# Altium schematic sheet Latch.SchDoc
size A4; SheetNumber: 5; SheetTotal: 6
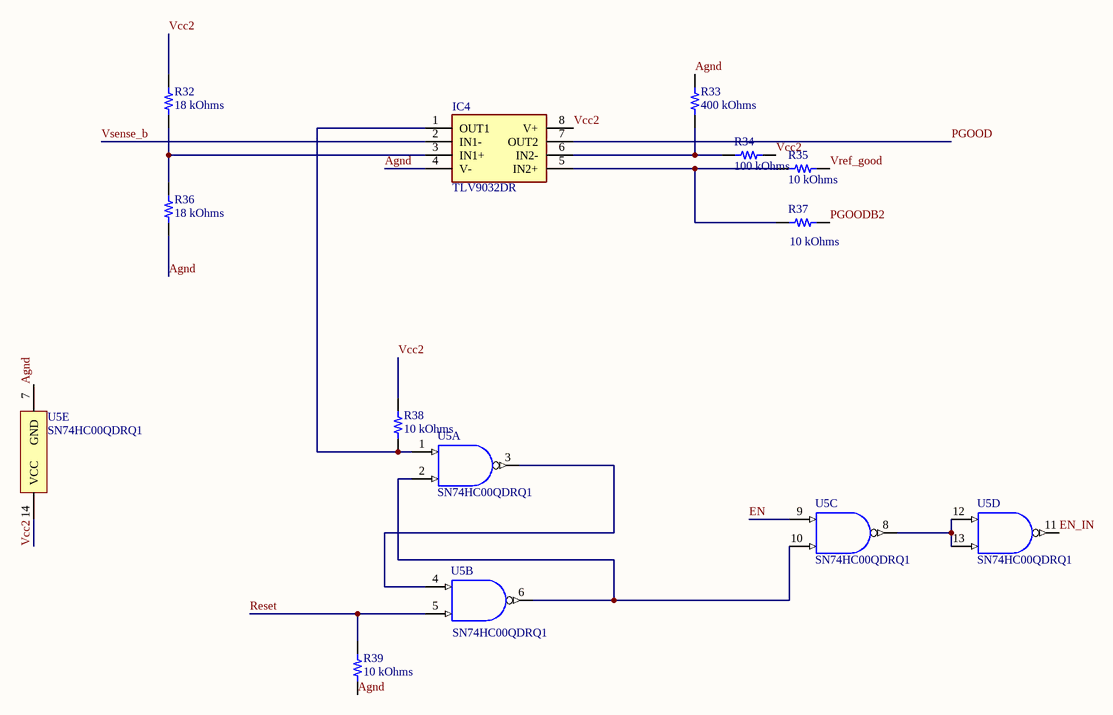
[diagram p0: Latch.SchDoc]

## Parts
IC4  TLV9032DR  [SOIC127P600X175-8N]
R32  18 kOhms  [RES 0603_1608]
R33  400 kOhms  [RES 0603_1608]
R34  100 kOhms  [RES 0603_1608]
R35  10 kOhms  [RES 0603_1608]
R36  18 kOhms  [RES 0603_1608]
R37  10 kOhms  [RES 0603_1608]
R38  10 kOhms  [RES 0603_1608]
R39  10 kOhms  [RES 0603_1608]
U5  SN74HC00QDRQ1  [D0014A_L]  (parts A,B,C,D,E of 5)

## Nets
Agnd: IC4.4(V-) R33.1 R36.2 R39.2 U5.7(GND)
EN: U5.9(3A)
EN_IN: U5.11(4Y)
PGOOD: IC4.7(OUT2)
PGOODB2: R37.1
Reset: R39.1 U5.5(2B)
Vcc2: IC4.8(V+) R32.1 R34.1 R38.1 U5.14(VCC)
Vref_good: R35.1
Vsense_b: IC4.2(IN1-)
NetIC4_1: IC4.1(OUT1) R38.2 U5.1(1A)
NetIC4_3: IC4.3(IN1+) R32.2 R36.1
NetIC4_5: IC4.5(IN2+) R35.2 R37.2
NetIC4_6: IC4.6(IN2-) R33.2 R34.2
NetU5_2: U5.2(1B) U5.6(2Y) U5.10(3B)
NetU5_3: U5.3(1Y) U5.4(2A)
NetU5_8: U5.8(3Y) U5.12(4A) U5.13(4B)

## Library data of the parts
IC4 = TLV9032DR: Integrated Circuit; Manufacturer_Name: Texas Instruments; Datasheet Link: https://www.ti.com/lit/gpn/tlv9032?HQS=ti-null-null-sf-df-pf-sep-wwe&DCM=yes; Height: 1.75mm; Manufacturer_Part_Number: TLV9032DR; Mouser Part Number: 595-TLV9032DR; Mouser Price/Stock: https://www.mouser.co.uk/ProductDetail/Texas-Instruments/TLV9032DR?qs=zW32dvEIR3vamhaxvfG%252Bkw%3D%3D; Arrow Part Number: TLV9032DR; Arrow Price/Stock: https://www.arrow.com/en/products/tlv9032dr/texas-instruments?region=nac
R32 R36 = ERJ-PB3B1802V: RES SMD 18K OHM 0.1% 1/5W 0603; Manufacturer: Panasonic Electronic Components; Power (Watts): 0.2W, 1/5W; Temperature Coefficient: ±50ppm/°C; Part Number: ERJ-PB3B1802V; Value: 18 kOhms; ComponentLink1Description: Datasheet; ComponentLink1URL: https://industrial.panasonic.com/cdbs/www-data/pdf/RDM0000/AOA0000C328.pdf; ComponentLink2Description: DigiKey Link; ComponentLink2URL: https://www.digikey.com/en/products/detail/panasonic-electronic-components/ERJ-PB3B1802V/6212896; Composition: Thick Film; Device Package: 0603 (1608 Metric); Features: Automotive AEC-Q200, Pulse Withstanding; Height - Seated (Max): 0.022" (0.55mm); LastUpdated: 12-07-2023 19:34:16; Lifecycle Status: Active; Minimum Order: 1; Number of Terminations: 2; Operating Temperature: -55°C ~ 155°C; Package / Case: 0603 (1608 Metric); Packaging: TapeAndReel; PartId: 4933; Part Status: Active; Price: 0.02; Ratings: AEC-Q200; Resistance: 18 kOhms; Series: ERJ-PB3; Size / Dimension: 0.063" L x 0.031" W (1.60mm x 0.80mm); Supplier 1: DigiKey; Supplier Part Number 1: P20113CT-ND; Supplier Device Package: 0603; Tolerance: ±0.1%
R33-R35 R37-R39 = CRGP0603F1K5: RES 1.5K OHM 1% 1/4W 0603; Manufacturer: TE Connectivity Passive Product; Power (Watts): 0.25W, 1/4W; Resistance: 1.5 kOhms; Temperature Coefficient: ±100ppm/°C; Part Number: CRGP0603F1K5; ComponentLink1Description: Datasheet; ComponentLink1URL: https://www.te.com/commerce/DocumentDelivery/DDEController?Action=srchrtrv&DocNm=9-1773463-9&DocType=DS&DocLang=English; ComponentLink2Description: DigiKey Link; ComponentLink2URL: https://www.digikey.com/en/products/detail/te-connectivity-passive-product/CRGP0603F1K5/8577020; Composition: Thick Film; Device Package: 0603 (1608 Metric); Features: Pulse Withstanding; Height - Seated (Max): 0.022" (0.55mm); LastUpdated: 12-07-2023 19:34:16; Lifecycle Status: Active; Minimum Order: 1; Number of Terminations: 2; Operating Temperature: -55°C ~ 155°C; Package / Case: 0603 (1608 Metric); Packaging: TapeAndReel; PartId: 5000; Part Status: Active; Price: 0.01; Series: CRGP; Size / Dimension: 0.063" L x 0.031" W (1.60mm x 0.80mm); Supplier 1: DigiKey; Supplier Part Number 1: A130418CT-ND; Supplier Device Package: 0603; Tolerance: ±1%
  R33: Value: 400 kOhms
  R34: Value: 100 kOhms
  R35 R37-R39: Value: 10 kOhms
U5 = CMP-1627-00175-2: Automotive Catalog Quad 2-Input Positive-NAND Gates, D0014A, LARGE T&R; Manufacturer: Texas Instruments; Generic Part Number: SN74HC00-Q1; Input Type: CMOS; Bits(#): 4; Output Drive (IOL/IOH)(Max)(mA): 5.2/-5.2; Technology Family: HC; Schmitt Trigger: No; ICC @ Nom Voltage(Max)(mA): 0.02; F @ Nom Voltage(Max)(Mhz): 70; VCC(Min)(V): 2; Voltage(Nom)(V): 5; tpd @ Nom Voltage(Max)(ns): 23; VCC(Max)(V): 6; Rating: Automotive; PackageReference: D0014A; Operating Temperature Range(C): -40 to 125; Code_JEDEC: MS-012; Output Type: CMOS; DatasheetVersion: SCLS575